# EAGLE design holmes_ups (EAGLE 7.3.0)
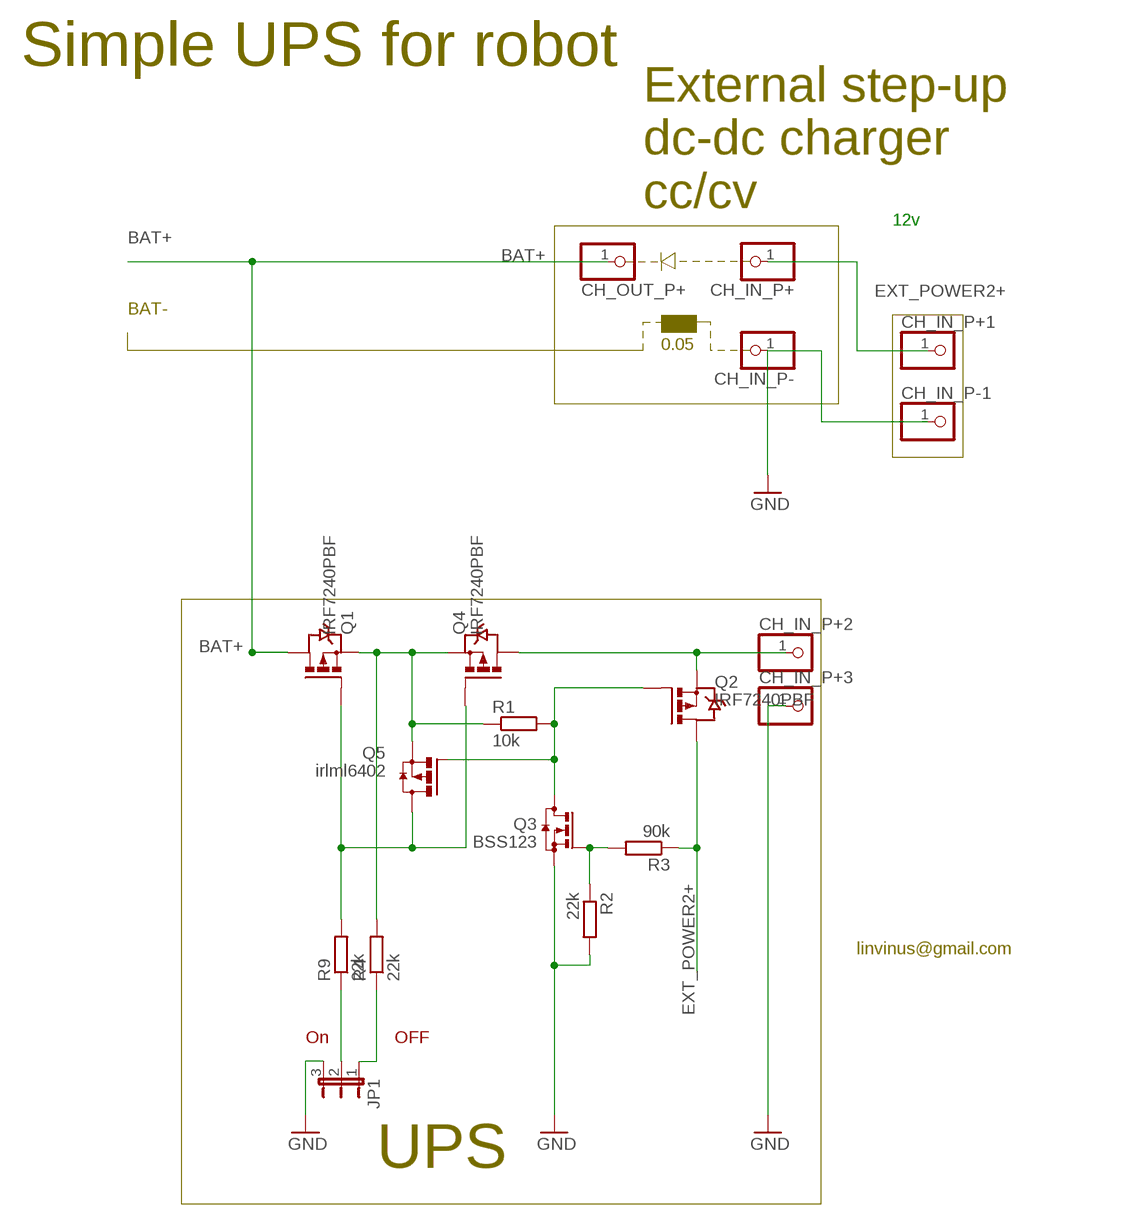
[diagram p0: schematic, sheet 1]

## Parts
CH_IN_P+  PINHD-1X1  [1X01]
CH_IN_P+1  PINHD-1X1  [1X01]
CH_IN_P+2  PINHD-1X1  [1X01]
CH_IN_P+3  PINHD-1X1  [1X01]
CH_IN_P-  PINHD-1X1  [1X01]
CH_IN_P-1  PINHD-1X1  [1X01]
CH_OUT_P+  PINHD-1X1  [1X01]
JP1  JP2E  [JP2]
Q1  IRF7240PBF  P-MOSFET-SO8  [SO-08]
Q2  IRF7240PBF  P-MOSFET-SO8  [SO-08]
Q3  BSS123  [SOT23]
Q4  IRF7240PBF  P-MOSFET-SO8  [SO-08]
Q5  irlml6402  FDN360P  [SUPER-SOT3]
R1  10k  R-EU_R0805  [R0805]
R2  22k  R-EU_R0805  [R0805]
R3  90k  R-EU_R0805  [R0805]
R4  22k  R-EU_R0805  [R0805]
R9  22k  R-EU_R0805  [R0805]

## Nets
BAT+: CH_OUT_P+.1 Q1.5(D) Q1.6(D) Q1.7(D) Q1.8(D)
EXT_POWER2+: CH_IN_P+1.1 CH_IN_P+.1 Q2.5(D) Q2.6(D) Q2.7(D) Q2.8(D) R3.1
GND: CH_IN_P+3.1 CH_IN_P-1.1 CH_IN_P-.1 JP1.3 Q3.2(S) R2.2
N$1: Q2.4(G) Q3.3(D) Q5.1(G) R1.2
N$2: Q3.1(G) R2.1 R3.2
N$4: JP1.2 R9.1
N$5: Q1.1(S) Q1.2(S) Q1.3(S) Q4.1(S) Q4.2(S) Q4.3(S) Q5.2(S) R1.1 R4.2
N$6: CH_IN_P+2.1 Q2.1(S) Q2.2(S) Q2.3(S) Q4.5(D) Q4.6(D) Q4.7(D) Q4.8(D)
N$7: JP1.1 R4.1
N$10: Q1.4(G) Q4.4(G) Q5.3(D) R9.2

## Notes on the sheet
- Simple UPS for robot
- External step-up 
  dc-dc charger
  cc/cv
- 12v
- BAT-
- 0.05
- linvinus@gmail.com
- On | OFF
- UPS

## Library data of the parts
CH_IN_P+ CH_IN_P+1-CH_IN_P+3 CH_IN_P- CH_IN_P-1 CH_OUT_P+ = pinhead:PINHD-1X1: PIN HEADER
JP1 = jumper:JP2E: JUMPER
Q1 Q2 Q4 = transistor-power:P-MOSFET-SO8: P-Channel MOSFET Example: FDS4435A; P-Channel Logic Level PowerTrench® MOSFET FDS4465; P-Channel 1.8V Specified PowerTrench® MOSFET Source: www.fairchildsemi.com
Q3 = transistor-small-signal:BSS123: N-CHANNEL MOS FET
Q5 = transistor-power:FDN360P: Single P-Channel, PowerTrench (R) MOSFET Source: http://www.fairchildsemi.com/ds/FD/FDN360P.pdf
R1-R4 R9 = resistor:R-EU_: RESISTOR, European symbol

## Board
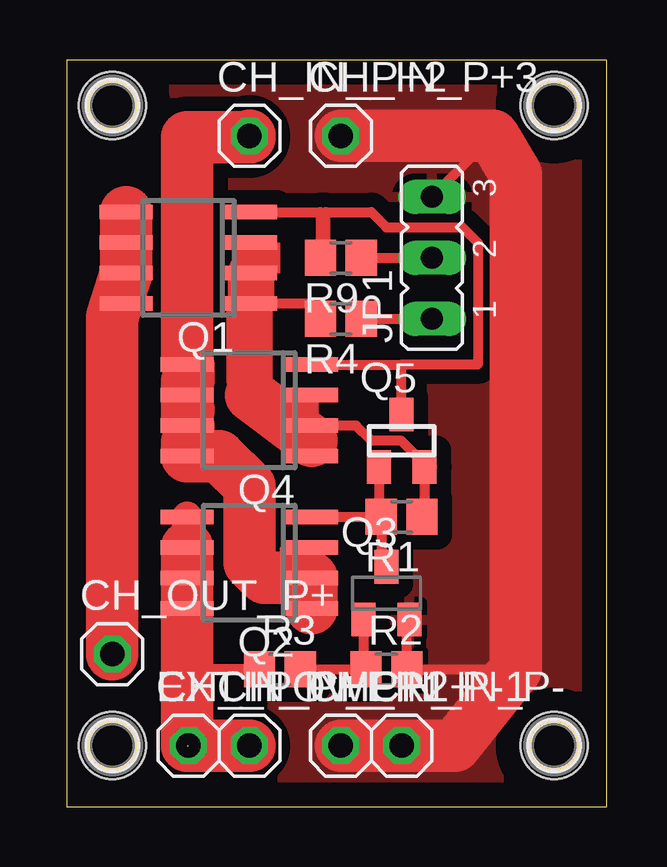
[diagram p1: board, top side]

Size 22.53 x 31.1 mm. Coordinates in mm from the lower left corner, seen from the top.
Outline: 0,0 22.53,0 22.53,31.1 0,31.1 0,0
Copper layers (1*16): Top 0.035mm / dielectric 1.5mm / Bottom 0.035mm
Design rules "default": minimum track width 10mil, minimum drill 24mil, track to track 8mil, track to pad 8mil, pad to pad 8mil, via to via 8mil, smd to smd 8mil, copper to edge 40mil, drill to drill 8mil, minimum pad ring 10mil, minimum via ring 8mil, stop-mask expansion 4mil, vias tented up to drill 0mil, thermal gap 10mil

### Footprints (pad centres in the part's own frame; a part is rotated, then mirrored left to right if it is on the bottom)
1X01 = drill 1.016 octagon: 1 0,0
JP2 = drill 0.914 long: 1 -2.54,0; 2 0,0; 3 2.54,0
SO-08 = smd 0.6 x 2.2: 1 -1.905,-2.6; 2 -0.635,-2.6; 3 0.635,-2.6; 4 1.905,-2.6; 5 1.905,2.6; 6 0.635,2.6; 7 -0.635,2.6; 8 -1.905,2.6
SOT23 = smd 1 x 1.4: 1 -0.95,-1.1; 2 0.95,-1.1; 3 0,1.1
SUPER-SOT3 = smd 1 x 1.4: 1 -0.95,-1.1; 2 0.95,-1.1; 3 0,1.1
R0805 = smd 1.3 x 1.5: 1 -0.85,0; 2 0.85,0
2 = hole 2.8: 0,0

### Placement (x,y rotation side)
CH_IN_P+  5.08,2.54 0 top
CH_IN_P+1  7.62,2.54 0 top
CH_IN_P+2  7.62,27.94 0 top
CH_IN_P+3  11.43,27.94 0 top
CH_IN_P-  13.97,2.54 0 top
CH_IN_P-1  11.43,2.54 0 top
CH_OUT_P+  1.9,6.35 0 top
EXT_POWER2+  [1X01]  5.08,2.54 0 top
JP1  15.24,22.86 90 top
Q1  5.08,22.86 90 top
Q2  7.62,10.16 90 top
Q3  13.33,8.89 0 top
Q4  7.62,16.51 90 top
Q5  13.97,15.24 0 top
R1  13.97,12.06 180 top
R2  13.33,5.71 0 top
R3  8.89,5.71 0 top
R4  11.43,20.32 180 top
R9  11.43,22.86 180 top
U$1  [2]  20.32,29.21 0 top
U$2  [2]  1.9,29.21 0 top
U$3  [2]  20.32,2.54 0 top
U$4  [2]  1.9,2.54 0 top

### Tracks (layer width: path | path; a pad name or v marks a point on that pad's centre or on a via)
BAT+
  Top 0.406: Q1.7 Q1.8
  Top 2.184: Q1.5 Q1.6 Q1.7 1.9,20.38 CH_OUT_P+.1
EXT_POWER2+  (1 unrouted)
  Top 0.406: R3.1 5.65,5.71 5.02,6.35
  Top 1.27: Q2.5 Q2.6
  Top 2.184: Q2.6 Q2.7 Q2.8 5.02,6.35 5.02,2.54 CH_IN_P+1.1
GND
  Top 0.406: 18.73,5.71 R2.2 14.18,7.69 Q3.2 | JP1.3 17.78,27.94
  Top 2.184: CH_IN_P-1.1 CH_IN_P-.1 16.2,2.54 18.73,5.71 18.73,26.35 17.78,27.94 CH_IN_P+3.1
  pour Top (isolate 0.61): -12.7,-1.27 24.13,-1.27 24.13,39.37 -12.7,39.37
N$1
  Top 0.406: Q5.1 13.02,12.17 R1.2 | Q2.4 R1.2 | R1.2 13.12,10.21 Q3.3
N$2
  Top 0.406: R3.2 R2.1 12.38,5.81 Q3.1
N$4
  Top 0.406: R9.1 JP1.2
N$5
  Top 0.406: Q4.1 10.22,15.24 Q4.2 12.06,15.87 12.7,15.24 13.97,15.24 15.07,14.14 | 7.62,20.95 Q1.1 10.16,20.95 10.58,20.53 R4.2 | 7.62,17.78 7.68,17.14 | 15.07,14.14 Q5.2 14.92,12.17 R1.1 | 15.24,14.14 15.07,14.14
  Top 0.61: Q1.2 Q1.3 | Q4.3 Q4.2
  Top 1.93: Q1.1 Q1.2 | 7.62,20.95 7.62,17.78
  Top 2.184: 7.68,17.14 10.22,15.24
N$6
  Top 0.406: 10.64,9.31 10.22,8.89 | Q2.2 Q2.3
  Top 2.184: Q2.1 10.22,8.89 Q2.2 8.25,9.53 7.62,10.16 7.62,13.33 6.35,14.6 Q4.8 5.02,15.18 5.08,15.24 5.08,15.81 Q4.7 5.02,16.45 5.08,16.51 5.02,16.57 Q4.6 5.02,17.72 5.08,17.78 5.08,18.35 Q4.5 5.02,27.88 7.62,27.88 CH_IN_P+2.1
N$7
  Top 0.406: R4.1 JP1.1
N$10
  Top 0.406: Q4.4 13.97,18.41 | Q1.4 10.58,24.77 R9.2 10.79,23.49 10.79,24.77 12.7,24.77 13.33,24.13 16.51,24.13 17.14,23.49 17.14,18.41 13.97,18.41 | Q5.3 13.97,18.41
(copper drawn outside any net)
  shapes: Top area x2